# EAGLE design music_badge_v1.2_2017-09-16 (EAGLE 6.4)
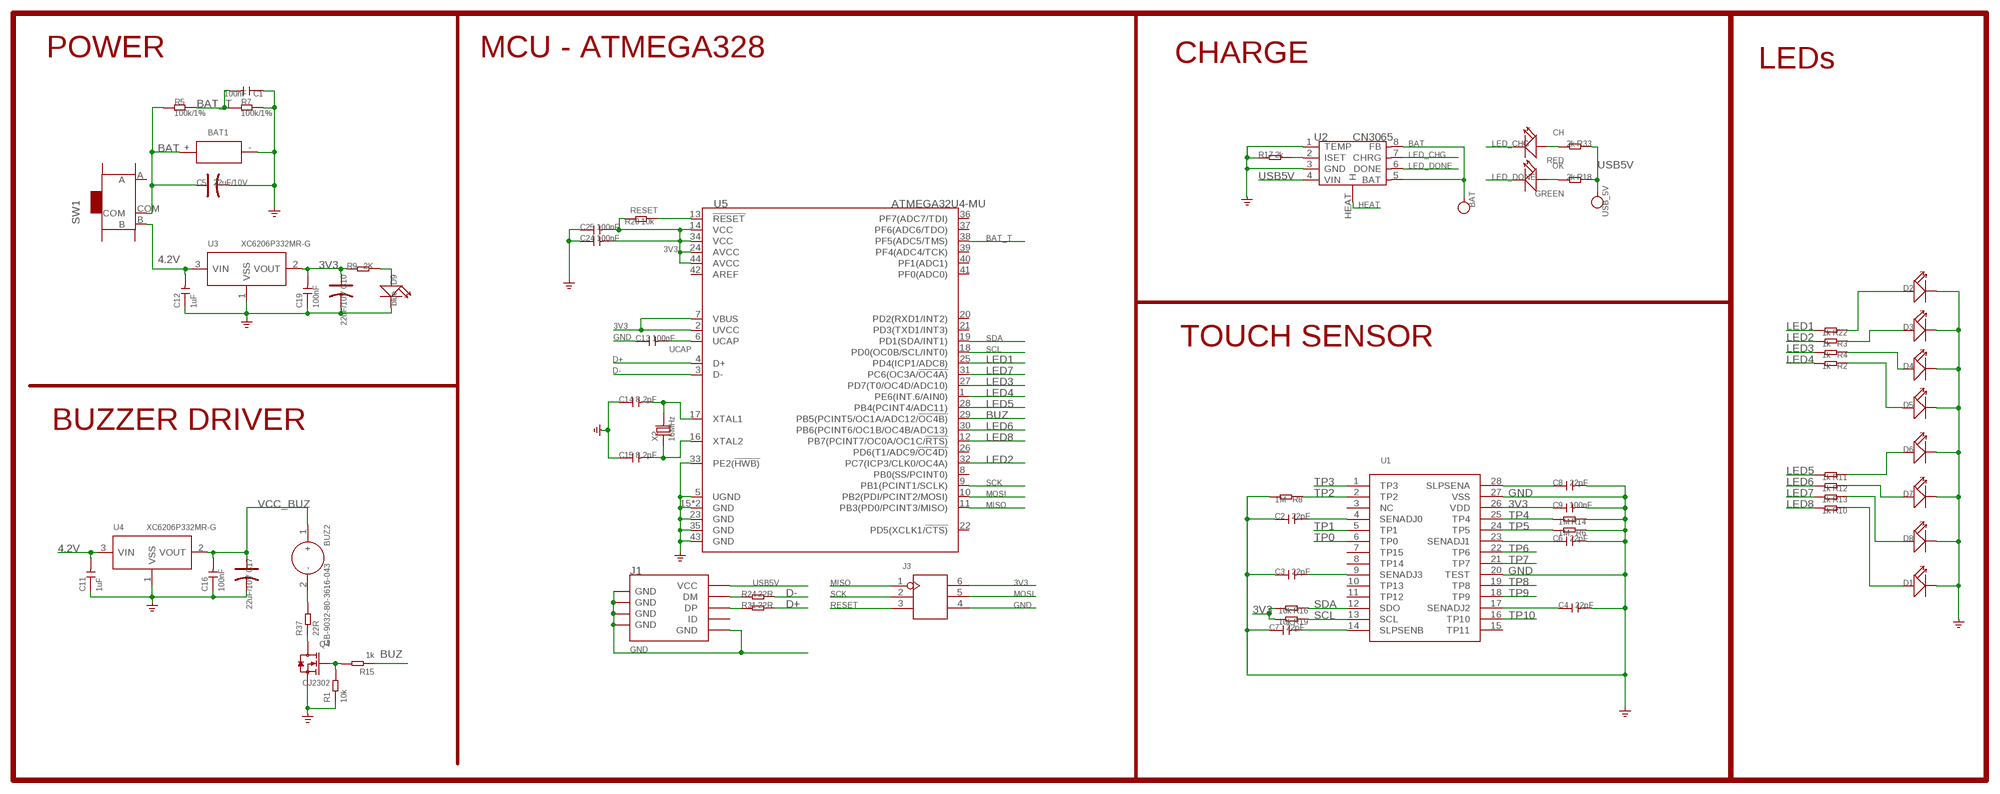
[diagram p0: schematic, sheet 1]

## Parts
BAT  TEST-POINT-35  [TP_3535]
BAT1  HOLDER-BATTERY  [2P-SMD-L28.5*W16*H5.5]
BUZ2  GB-9032-80-3616-043  BUZZER-9X3.2MM  [BZ2-SMD-9X10.6X3.2MM]
C1  100nF  C-0603  [C0603]
C2  22pF  C-0603  [C0603]
C3  22pF  C-0603  [C0603]
C4  22pF  C-0603  [C0603]
C5  22uF/10V  CAP-AVX-B  [AVX-B]
C6  22pF  C-0603  [C0603]
C7  22pF  C-0603  [C0603]
C8  22pF  C-0603  [C0603]
C9  100nF  C-0603  [C0603]
C10  22uF/10V  CAP-AVX-B  [AVX-B]
C11  1uF  CAP-0603  [C0603]
C12  1uF  CAP-0603  [C0603]
C13  100nF  C-0603  [C0603]
C14  8.2pF  C-0603  [C0603]
C15  8.2pF  C-0603  [C0603]
C16  100nF  CAP-0603  [C0603]
C17  22uF/10V  CAP-AVX-B  [AVX-B]
C19  100nF  CAP-0603  [C0603]
C24  100nF  C-0603  [C0603]
C25  100nF  C-0603  [C0603]
CH  RED  LED'0603'  [LED-0603]
D1  LED-3MM  [LED-2P-2.54-3MM]
D2  LED-3MM  [LED-2P-2.54-3MM]
D3  LED-3MM  [LED-2P-2.54-3MM]
D4  LED-3MM  [LED-2P-2.54-3MM]
D5  LED-3MM  [LED-2P-2.54-3MM]
D6  LED-3MM  [LED-2P-2.54-3MM]
D7  LED-3MM  [LED-2P-2.54-3MM]
D8  LED-3MM  [LED-2P-2.54-3MM]
D9  blue  LED'0603'  [LED-0603@1]
J1  USB-MINIUSB-5P-MICRO  [MICRO-USB]
J3  HEADER-2X3P-2.0-1.143  [H2X3-SMD-2.0(1.143)]
OK  GREEN  LED'0603'  [LED-0603]
Q4  CJ2302  MOSFET-N'SOT23'  [SOT-23]
R1  10k  RES-0603  [R0603]
R2  1k  R-0603  [R0603]
R3  1k  R-0603  [R0603]
R4  1k  R-0603  [R0603]
R5  100k/1%  R-0603  [R0603]
R6  1M  R-0603  [R0603]
R7  100k/1%  R-0603  [R0603]
R8  1M  R-0603  [R0603]
R9  2K  R-0603  [R0603]
R10  1k  R-0603  [R0603]
R11  1k  R-0603  [R0603]
R12  1k  R-0603  [R0603]
R13  1k  R-0603  [R0603]
R14  1M  R-0603  [R0603]
R15  1k  RES-0603  [R0603]
R16  10k  R-0603  [R0603]
R17  2k  R-0603  [R0603]
R18  2k  R-0603  [R0603]
R19  10k  R-0603  [R0603]
R20  10k  R-0603  [R0603]
R22  1k  R-0603  [R0603]
R24  22R  R-0603  [R0603]
R31  22R  R-0603  [R0603]
R33  2k  R-0603  [R0603]
R37  22R  RES-0603  [R0603]
SW1  SWITCH-3P-SMD-6.6X2.8  [3P-SMD-2CH-6.6X2.8-REINFORCE]
U1  TTP229-BSF  [SSOP28-0.635-10X4MM]
U2  CN3065  CN3065-DFN8  [DFN8]
U3  XC6206P332MR-G  PMIC-XC6206PMR  [SOT-23]
U4  XC6206P332MR-G  PMIC-XC6206PMR  [SOT-23]
U5  ATMEGA32U4-MU  [QFN44]
USB_5V  TEST-POINT-35  [TP_3535]
X2  16MHz  CRYSTAL'5032'  [2P-SMD-5X3.2]

## Nets
3V3: C9.1 C10.+ C19.2 C24.2 C25.2 J3.6 R9.1 R16.2 R19.2 R20.1 U1.26(VDD) U3.2(VOUT) U5.2(UVCC) U5.7(VBUS) U5.14(VCC) U5.24(AVCC) U5.34(VCC) U5.44(AVCC)
4.2V: C11.2 C12.2 SW1.B U3.3(VIN) U4.3(VIN)
BAT: BAT1.+ BAT.T C5.+ R5.1 SW1.COM U2.5(BAT) U2.8(FB)
BAT_T: C1.2 R5.2 R7.1 U5.38(PF5(ADC5/TMS))
BUZ: R15.1 U5.29(PB5(PCINT5/OC1A/ADC12/!OC4B))
D+: R31.2 U5.4(D+)
D-: R24.2 U5.3(D-)
GND [none1]: BAT1.- C1.1 C2.1 C3.1 C4.2 C5.- C6.2 C7.1 C8.2 C9.2 C10.- C11.1 C12.1 C13.1 C14.1 C15.1 C16.1 C17.- C19.1 C24.1 C25.1 D1.K(-) D2.K(-) D3.K(-) D4.K(-) D5.K(-) D6.K(-) D7.K(-) D8.K(-) D9.- J1.5(GND) J1.S1(GND) J1.S2(GND) J1.S3(GND) J1.S4(GND) J1.S5(GND) J1.S6(GND) J3.4 Q4.2(S) R1.1 R6.1 R7.2 R8.2 R14.1 R17.1 U1.20(TEST) U1.27(VSS) U2.1(TEMP) U2.3(GND) U3.1(VSS) U4.1(VSS) U5.5(UGND) U5.15(GND) U5.23(GND) U5.33(PE2(!HWB)) U5.35(GND) U5.43(GND) U5.TAB(GND) ; supply symbol labelled GND_POWER
HEAT: U2.HEAT(H)
LED1: R22.2 U5.25(PD4(ICP1/ADC8))
LED2: R3.2 U5.32(PC7(ICP3/CLK0/OC4A))
LED3: R4.2 U5.27(PD7(T0/OC4D/ADC10))
LED4: R2.2 U5.1(PE6(INT.6/AIN0))
LED5: R11.2 U5.28(PB4(PCINT4/ADC11))
LED6: R12.2 U5.30(PB6(PCINT6/OC1B/OC4B/ADC13))
LED7: R13.2 U5.31(PC6(OC3A/!OC4A))
LED8: R10.2 U5.12(PB7(PCINT7/OC0A/OC1C/!RTS))
LED_CHG: CH.- U2.7(CHRG)
LED_DONE: OK.- U2.6(DONE)
MISO: J3.1 U5.11(PB3(PD0/PCINT3/MISO))
MOSI: J3.5 U5.10(PB2(PDI/PCINT2/MOSI))
N$1: C2.2 U1.4(SENADJ0)
N$2: C3.2 U1.9(SENADJ3)
N$3: D9.+ R9.2
N$4: C7.2 U1.14(SLPSENB)
N$5: C6.1 U1.23(SENADJ1)
N$6: C14.2 U5.17(XTAL1) X2.2
N$7: R17.2 U2.2(ISET)
N$8: C4.1 U1.17(SENADJ2)
N$9: C8.1 U1.28(SLPSENA)
N$10: OK.+ R18.2
N$11: BUZ2.2(-) R37.2
N$12: C15.2 U5.16(XTAL2) X2.1
N$13: CH.+ R33.2
N$14: D6.A(+) R11.1
N$15: D2.A(+) R22.1
N$16: D7.A(+) R12.1
N$17: D1.A(+) R10.1
N$18: J1.2(DM) R24.1
N$19: Q4.1(G) R1.2 R15.2
N$20: D4.A(+) R4.1
N$21: D3.A(+) R3.1
N$22: D5.A(+) R2.1
N$24: D8.A(+) R13.1
N$27: J1.3(DP) R31.1
N$43: Q4.3(D) R37.1
RESET: J3.3 R20.2 U5.13(!RESET)
SCK: J3.2 U5.9(PB1(PCINT1/SCLK))
SCL: R19.1 U1.13(SCL) U5.18(PD0(OC0B/SCL/INT0))
SDA: R16.1 U1.12(SDO) U5.19(PD1(SDA/INT1))
TP0: U1.6(TP0)
TP1: U1.5(TP1)
TP2: R8.1 U1.2(TP2)
TP3: U1.1(TP3)
TP4: R14.2 U1.25(TP4)
TP5: R6.2 U1.24(TP5)
TP6: U1.22(TP6)
TP7: U1.21(TP7)
TP8: U1.19(TP8)
TP9: U1.18(TP9)
TP10: U1.16(TP10)
UCAP: C13.2 U5.6(UCAP)
USB5V: J1.1(VCC) R18.1 R33.1 U2.4(VIN) USB_5V.T
VCC_BUZ: BUZ2.1(+) C16.2 C17.+ U4.2(VOUT)
Unconnected: J1.4(ID) SW1.A SW1.SS1 SW1.SS2 SW1.SS3 SW1.SS4 U1.3(NC) U1.7(TP15) U1.8(TP14) U1.10(TP13) U1.11(TP12) U1.15(TP11) U5.8(PB0(SS/PCINT0)) U5.20(PD2(RXD1/INT2)) U5.21(PD3(TXD1/INT3)) U5.22(PD5(XCLK1/!CTS)) U5.26(PD6(T1/ADC9/!OC4D)) U5.36(PF7(ADC7/TDI)) U5.37(PF6(ADC6/TDO)) U5.39(PF4(ADC4/TCK)) U5.40(PF1(ADC1)) U5.41(PF0(ADC0)) U5.42(AREF)

## Notes on the sheet
- POWER | MCU - ATMEGA328 | CHARGE
- LEDs
- TOUCH SENSOR
- BUZZER DRIVER

## Library data of the parts
BAT USB_5V = Discrete-new:TEST-POINT
BAT1 = goodman:HOLDER-BATTERY
BUZ2 = Discrete-new:BUZZER: BZ2-5.0-D9.0XH5.5MM: 312020001;BZ2-7.6-D12.0XH6.5MM: 312020006; BZ3-SMD-5.0X5.0X2.5MM:312020004
C1-C4 C6-C9 C13-C15 C24 C25 = Discrete:C*: Ceramic Capacitors
C5 C10 C17 = Discrete:CAP*: Electrolytic Capacitors,Tantalum Capacitors and Super Capacitors
C11 C12 C16 C19 = Discrete-new:CAP: Ceramic Capacitors
CH OK = Discrete-new:LED
D1-D9 = Discrete:LED*
J1 = Connector :USB-MINIUSB-5P
J3 = Connector-new:HEADER-2X3P
Q4 = Discrete-new:MOSFET-N
R1 R15 R37 = Discrete-new:RES
R2-R14 R16-R20 R22 R24 R31 R33 = Discrete:R*
SW1 = Discrete:SWITCH-3P-SMD
U1 = IC-new:TTP229-BSF
U2 = IC:CN3065: USB-Compatible Lithiumt-Ion Battery Charger with Thermal Regulation http://www.consonance-elec.com/pdf/%E6%8A%80%E6%9C%AF%E8%AF%B4%E6%98%8E%E4%B9%A6/DSC-CN3065.pdf
U3 U4 = IC-new:PMIC-XC6206P: LOW ESR Cap.Compatible Positive Voltage Regulators
U5 = IC:ATMEGA32U4: 8-bit Microcontroller With 16/32K Bytes of ISP Flash and USB controller
X2 = Discrete:CRYSTAL*: CRYSTAL

## Net classes
0 default: width 0.203 mm, drill 0.254 mm, clearance 0.152 mm

## Board
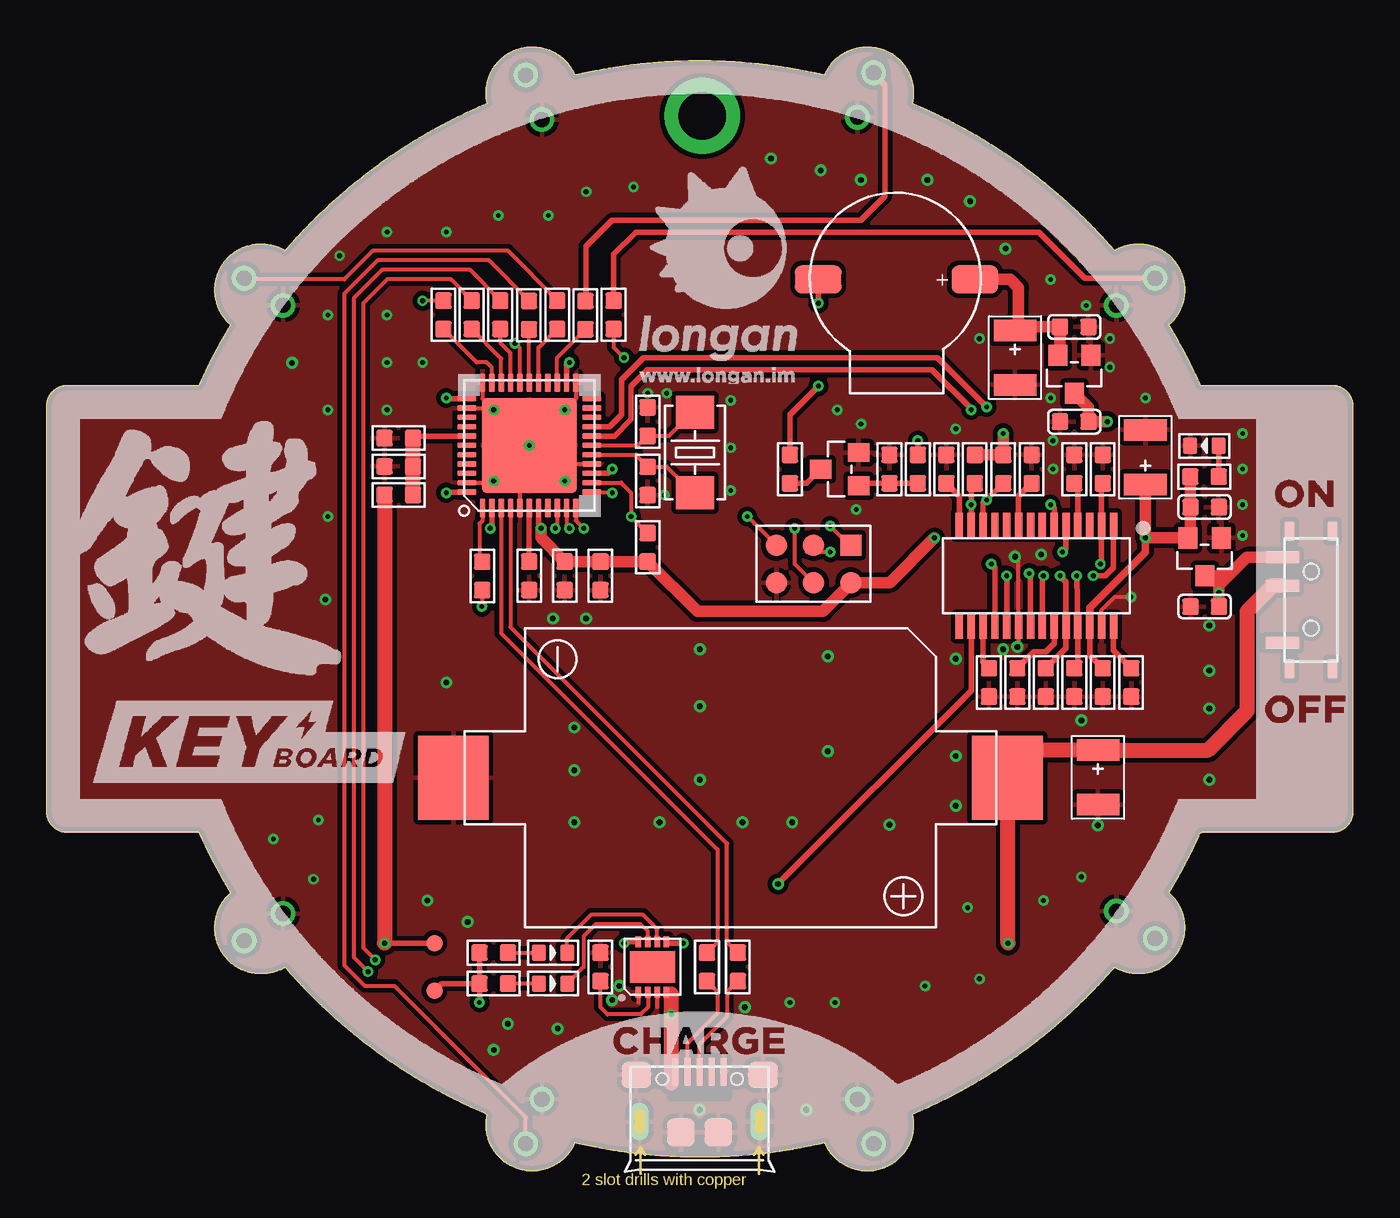
[diagram p1: board, top side]
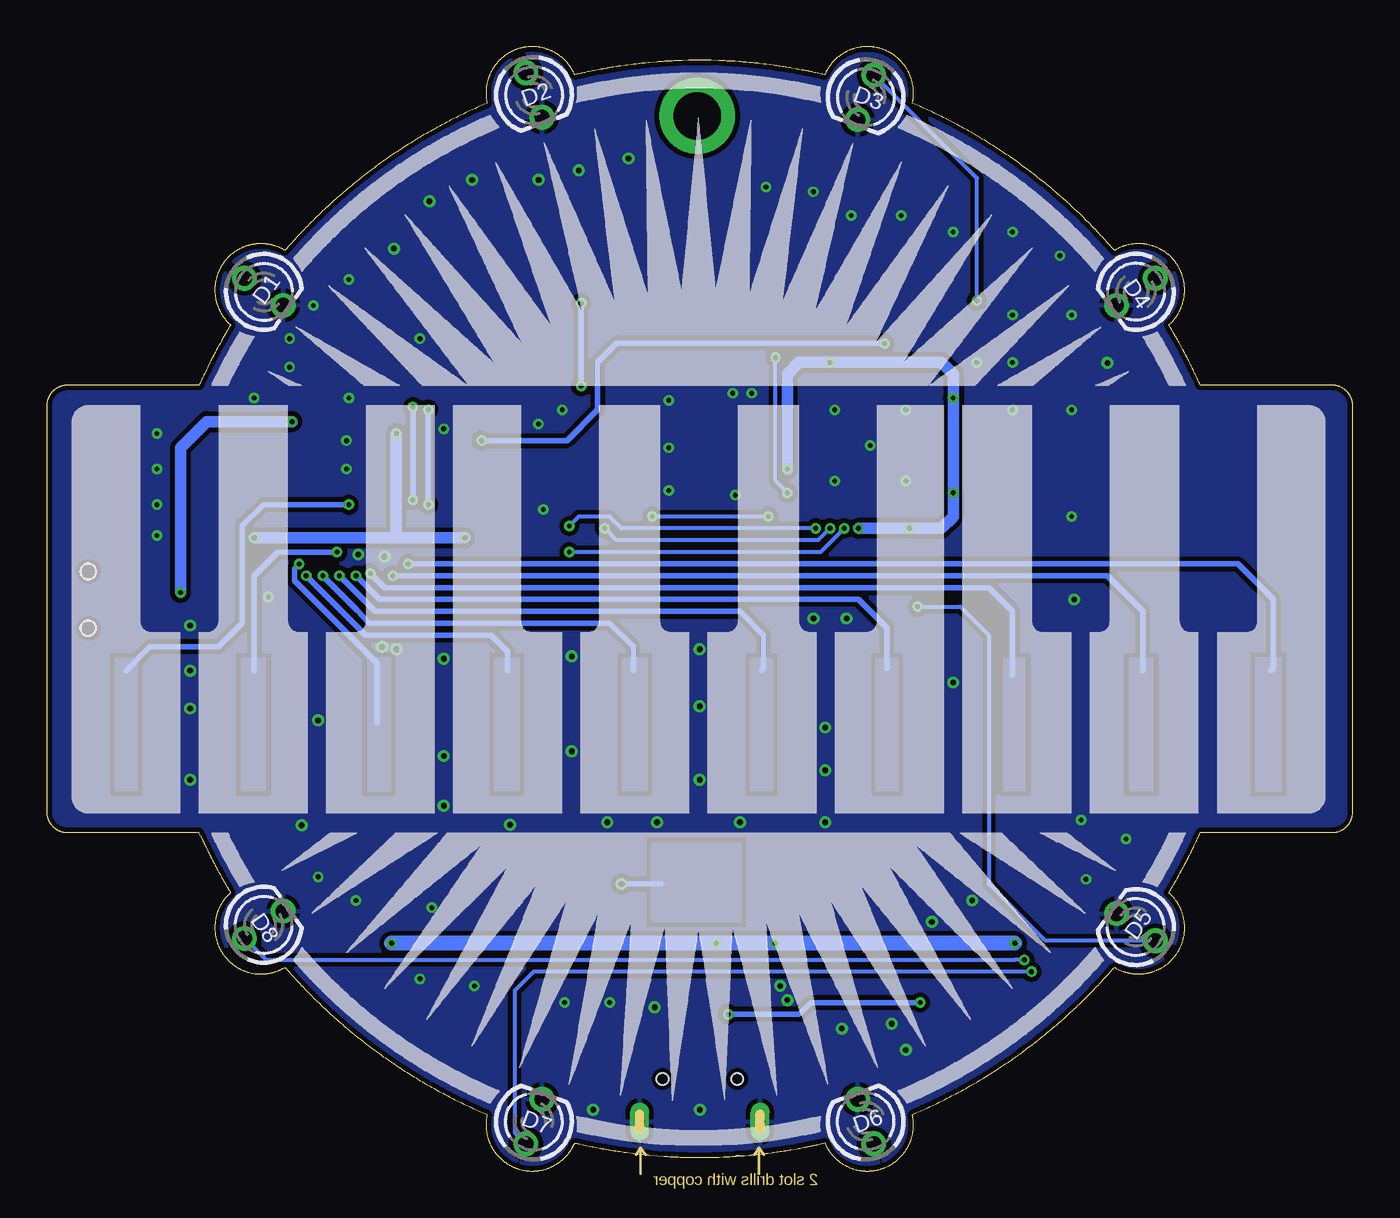
[diagram p2: board, bottom side, seen from below]

Size 70 x 60.23 mm. Coordinates in mm from the lower left corner, seen from the top.
Outline: 2617 segments
Copper layers (1*16): Top 0.035mm / dielectric 1.5mm / Bottom 0.035mm
Design rules "SeeedStudio_2layer_DRU_no_angle_20140221 *": minimum track width 6mil, minimum drill 10mil, track to track 6mil, track to pad 6mil, pad to pad 6mil, via to via 6mil, smd to smd 0mil, copper to edge 10mil, drill to drill 10mil, minimum pad ring 10mil, minimum via ring 6mil, stop-mask expansion 2mil, vias tented up to drill 25mil, thermal gap 10mil

### Footprints (pad centres in the part's own frame; a part is rotated, then mirrored left to right if it is on the bottom)
TP_3535 = smd 0.889 x 0.889: T 0,0
2P-SMD-L28.5*W16*H5.5 = smd 3.8 x 4.5: + 14.85,0; - -14.85,0
BZ2-SMD-9X10.6X3.2MM = smd 2.5 x 1.5: 1 4.2,0; 2 -4.2,0
C0603 = smd 0.889 x 0.889: 1 -0.762,0; 2 0.762,0
AVX-B = smd 1.143 x 2.286: + -1.46,0; - 1.46,0
C0603' = smd 0.889 x 0.889: 1 0,0.762; 2 0,-0.762
LED-0603 = smd 0.762 x 0.889: + 0.762,0; - -0.762,0
LED-2P-2.54-3MM = drill 0.813: A -1.27,0; K 1.27,0
LED-0603' = smd 0.762 x 0.889: + -0.762,0; - 0.762,0
MICRO-USB = smd 0.381 x 1.524: 1 -1.3,-0.25; 2 -0.65,-0.25; 3 0,-0.25; 4 0.65,-0.25; 5 1.3,-0.25 | smd 1.6 x 1.397: S1 -3.4,-0.427; S6 3.4,-0.427 | drill 0.508 pad 1.016 long: S2 -3.226,-2.921; S5 3.226,-2.921 | smd 1.5 x 1.5: S3 -1,-3.5; S4 1,-3.5 | hole 0.635: -2,-0.65; 2,-0.65
H2X3-SMD-2.0(1.143) = smd 1.143 x 1.143: 1 -1,2; 2 -1,0; 3 -1,-2; 4 1,-2; 5 1,0; 6 1,2
SOT-23 = smd 1.143 x 1.016: 1 1.016,-0.889; 2 1.016,0.889; 3 -1.016,0
R0603 = smd 0.889 x 0.889: 1 0,0.762; 2 0,-0.762
R0603' = smd 0.889 x 0.889: 1 -0.762,0; 2 0.762,0
3P-SMD-2CH-6.6X2.8-REINFORCE = smd 1.778 x 0.635: A 1.524,2.286; B 1.524,-2.286; COM 1.524,-0.762 | smd 0.508 x 1.016: SS1 -1.143,-3.683; SS2 1.143,-3.683; SS3 1.143,3.683; SS4 -1.143,3.683 | hole 0.813: 0,-1.524; 0,1.524
SSOP28-0.635-10X4MM = smd 0.4 x 1.3: 1 -4.128,-2.723; 2 -3.493,-2.723; 3 -2.857,-2.723; 4 -2.223,-2.723; 5 -1.587,-2.723; 6 -0.953,-2.723; 7 -0.318,-2.723; 8 0.318,-2.723; 9 0.953,-2.723; 10 1.587,-2.723; 11 2.223,-2.723; 12 2.857,-2.723; 13 3.493,-2.723; 14 4.128,-2.723; 15 4.128,2.723; 16 3.493,2.723; 17 2.857,2.723; 18 2.223,2.723; 19 1.587,2.723; 20 0.953,2.723; 21 0.318,2.723; 22 -0.318,2.723; 23 -0.953,2.723; 24 -1.587,2.723; 25 -2.223,2.723; 26 -2.857,2.723; 27 -3.493,2.723; 28 -4.128,2.723
DFN8 = smd 0.3 x 0.6: 1 -0.75,-1.35; 2 -0.25,-1.35; 3 0.25,-1.35; 4 0.75,-1.35; 5 0.75,1.35; 6 0.25,1.35; 7 -0.25,1.35; 8 -0.75,1.35 | smd 2.4 x 1.7: HEAT 0,0
SOT-23' = smd 1.016 x 1.143: 1 -0.889,-1.016; 2 0.889,-1.016; 3 0,1.016
QFN44 = smd 1 x 0.3: 1 -3.35,2.5; 2 -3.35,2; 3 -3.35,1.5; 4 -3.35,1; 5 -3.35,0.5; 6 -3.35,0; 7 -3.35,-0.5; 8 -3.35,-1; 9 -3.35,-1.5; 10 -3.35,-2; 11 -3.35,-2.5; 23 3.35,-2.5; 24 3.35,-2; 25 3.35,-1.5; 26 3.35,-1; 27 3.35,-0.5; 28 3.35,0; 29 3.35,0.5; 30 3.35,1; 31 3.35,1.5; 32 3.35,2; 33 3.35,2.5 | smd 0.3 x 1: 12 -2.5,-3.35; 13 -2,-3.35; 14 -1.5,-3.35; 15 -1,-3.35; 16 -0.5,-3.35; 17 0,-3.35; 18 0.5,-3.35; 19 1,-3.35; 20 1.5,-3.35; 21 2,-3.35; 22 2.5,-3.35; 34 2.5,3.35; 35 2,3.35; 36 1.5,3.35; 37 1,3.35; 38 0.5,3.35; 39 0,3.35; 40 -0.5,3.35; 41 -1,3.35; 42 -1.5,3.35; 43 -2,3.35; 44 -2.5,3.35 | smd 5.08 x 5.08: TAB 0,0
2P-SMD-5X3.2 = smd 1.778 x 2.032: 1 -2.159,0; 2 2.159,0

### Placement (x,y rotation side)
BAT  20.78,12.2 0 top
BAT1  36.65,21.07 0 top
BUZ2  45.55,47.76 0 top
C1  18.87,39.27 0 top
C2  55.07,37.6 270 top
C3  52.79,37.6 270 top
C4  50.5,26.17 270 top
C5  56.34,21.09 270 top
C6  52.02,26.17 270 top
C7  48.21,37.6 270 top
C8  58.12,26.17 270 top
C9  56.6,26.17 270 top
C10  58.88,38.24 90 top
C11  1uF  [C0603']  55.07,40.14 90 top
C12  1uF  [C0603']  62.06,30.24 90 top
C13  25.86,31.89 90 top
C14  32.21,40.14 270 top
C15  32.21,36.97 90 top
C16  100nF  [C0603']  55.07,45.22 270 top
C17  51.9,43.57 270 top
C19  100nF  [C0603']  62.06,35.57 270 top
C24  27.77,31.89 90 top
C25  29.67,31.89 90 top
CH  27.13,10.05 180 top
D1  58.36,47.1 325 bottom
D2  43.88,57.65 290 bottom
D3  26.1,57.52 250 bottom
D4  11.63,47.1 215 bottom
D5  11.63,13.07 145 bottom
D6  26.1,2.65 110 bottom
D7  43.88,2.65 70 bottom
D8  58.36,13.2 35 bottom
D9  blue  [LED-0603']  62.05,38.85 180 top
J1  34.99,5.58 0 top
J3  41.1,32.52 270 top
OK  27.13,11.7 180 top
Q4  42.5,37.6 0 top
R1  45.17,37.6 0 top
R2  1k  [R0603']  23.35,31.88 90 top
R3  1k  [R0603']  21.26,45.87 270 top
R4  1k  [R0603']  27.36,45.87 270 top
R5  100k/1%  [R0603']  18.87,36.22 0 top
R6  1M  [R0603']  53.55,26.17 90 top
R7  100k/1%  [R0603']  18.87,37.74 180 top
R8  1M  [R0603']  56.6,37.6 90 top
R9  2K  [R0603']  62.05,37.2 0 top
R10  1k  [R0603']  30.38,45.87 270 top
R11  1k  [R0603']  25.85,45.85 270 top
R12  1k  [R0603']  24.3,45.87 270 top
R13  1k  [R0603']  22.78,45.87 270 top
R14  1M  [R0603']  55.07,26.17 90 top
R15  46.69,37.6 0 top
R16  10k  [R0603']  51.26,37.6 90 top
R17  2k  [R0603']  29.67,10.93 270 top
R18  2k  [R0603']  23.96,11.7 0 top
R19  10k  [R0603']  49.74,37.6 90 top
R20  10k  [R0603']  32.21,33.41 90 top
R22  1k  [R0603']  28.87,45.85 270 top
R24  22R  [R0603']  35.39,10.93 90 top
R31  22R  [R0603']  37.04,10.93 90 top
R33  2k  [R0603']  23.96,10.05 0 top
R37  39.83,37.6 180 top
SW1  67.76,30.59 180 top
U1  53.04,31.89 180 top
U2  32.47,10.93 0 top
U3  XC6206P332MR-G  [SOT-23']  62.06,32.91 180 top
U4  XC6206P332MR-G  [SOT-23']  55.07,42.68 180 top
U5  25.86,38.87 90 top
USB_5V  20.78,9.66 0 top
X2  34.75,38.49 90 top

### Tracks (layer width: path | path; a pad name or v marks a point on that pad's centre or on a via)
3V3  (via drill 0.25 pad 0.51)
  Top 0.305: U5.24 27.86,43.16 v28.02,43.32 | U5.14 30.08,37.37 v30.31,37.6 | U5.34 21.46,41.37 v21.42,41.41 | U5.44 21.46,36.37 v21.42,36.33 | U5.2 23.86,34.53 v23.77,34.43 | U5.7 26.36,34.56 v26.5,34.43 | U1.26 55.9,27.64 C9.1
  Top 0.406: v58.88,33.92 58.88,33.16 55.9,30.18 U1.26
  Top 0.61: R9.1 C19.2 61.29,34.05 U3.2 v58.88,33.92 C10.+ | v47.58,33.92 45.18,31.52 J3.6 43.1,31.48 41.61,29.98 34.88,29.98 R20.1 C25.2 C24.2 26.5,33.92 v26.5,34.43 | R19.2 R16.2 v51.26,39.51
  Bottom 0.305: v26.5,34.43 25.73,34.43
  Bottom 0.61: v30.31,37.6 30.31,42.68 29.67,43.32 v28.02,43.32 22.05,43.32 21.42,42.68 v21.42,41.41 v21.42,36.33 21.42,35.06 22.05,34.43 v23.77,34.43 v26.5,34.43 | v58.88,33.92 51.26,33.92 | 51.26,33.92 v47.58,33.92 | v51.26,39.51 51.26,33.92
4.2V  (via drill 0.25 pad 0.51)
  Top 0.61: U3.3 62.69,31.89 | 62.69,31.89 63.33,31.89 | 63.33,31.89 64.32,32.88 SW1.B | 62.69,31.89 62.82,31.76 v62.82,31 C12.2 | 63.33,31.89 62.95,31.51 | U4.3 55.83,40.91 C11.2 v56.85,40.14
  Bottom 0.61: v62.82,31 62.82,38.75 61.42,40.14 v56.85,40.14
BAT  (via drill 0.25 pad 0.51)
  Top 0.305: U2.8 31.02,12.28 v30.94,12.2 | v34.12,12.2 33.3,12.2 U2.5 | 18.1,12.21 20.77,12.21 BAT.T
  Top 0.813: 55.66,22.63 C5.+ | C5.+ 51.58,22.55 51.52,22.62 51.52,21.09 BAT1.+ 51.52,21.05 v51.52,12.2 | C5.+ 62.25,22.55 64.34,24.65 64.34,29.98 65.71,31.36 SW1.COM | R5.1 18.1,12.21 v18.11,12.2
  Bottom 0.813: v51.52,12.2 v34.12,12.2 v30.94,12.2 v18.11,12.2
BAT_T
  Top 0.305: U5.38 19.73,39.37 C1.2
  Top 0.813: R5.2 R7.1 C1.2
BUZ  (via drill 0.25, 0.25 pad 0.51)
  Top 0.203: U5.29 25.36,44.07 v25.1,44.34
  Top 0.305: v46.69,39.13 R15.1
  Bottom 0.305: v25.1,44.34 39.45,44.34 40.47,43.32 40.47,40.78 42.12,39.13 v46.69,39.13
D+
  Top 0.203: U5.4 24.86,29.14 36.47,17.54 36.47,12.27 R31.2
D-
  Top 0.203: U5.3 24.36,28.82 35.96,17.22 35.96,12.27 R24.2
GND  (via drill 0.25 pad 0.51, 0.3 pad 0.64)
  Top 0.203: U5.35 23.86,40.87 v23.96,40.78 23.36,41.37 U5.33 | U5.15 26.89,37.87 26.88,37.86 | v27.77,36.97 26.88,37.86 | U5.5 25.36,36.98 26.24,37.86 26.88,37.86 | U5.43 23.86,36.87 v23.96,36.97 | U2.3 32.72,8.78 | U2.1 31.72,9.04 31.7,9.03 | U5.23 28.36,41.37 v27.77,40.78 | 52.02,27.95 52.09,28.02 U1.20 52.09,32.97 51.9,33.16 | U1.27 56.53,30.05 57.23,30.75 v58.12,30.75
  other vias: 34.99,3.29 40.71,3.29 13.15,43.29 37.42,8.78 25.86,38.87 18.24,40.78 18.24,43.32 18.24,45.86 20.15,43.32 30.69,9.92 24.72,7.89 27.39,7.63 14.94,30.62 20.4,14.49 23.96,6.49 22.56,13.35 21.42,26.17 56.33,18.53 39.83,9.03 42.24,9.03 47.07,9.92 49.99,10.3 49.36,14.11 53.42,14.49 14.3,15.63 14.56,18.81 12.15,17.79 28.91,52.46 15.07,35.06 15.07,40.78 15.07,45.86 15.7,49.03 18.24,50.3 21.42,50.3 24.21,51.19 33.1,36.21 32.21,41.67 33.23,41.67 58.88,41.41 55.45,15.76 56.98,44.59 64.09,35.7 64.09,37.6 64.09,39.51 27.13,29.6 28.91,29.6 52.02,28.08 26.88,51.19 31.45,52.72 53.8,47.76 55.71,46.37 42.37,40.78 43.39,35.45 53.8,41.41 49.99,44.59 64.09,34.05 51.26,27.95 51.9,32.91 53.29,33.03 56.98,43.07 43.64,40.02 48.72,39.76 53.93,37.6 53.93,39.13 36.66,38.75 36.66,36.46 36.66,41.29 30.31,9.16 55.45,24.14 62.31,29.22 62.31,26.81 62.31,24.78 62.31,20.97 48.72,27.44 48.72,22.24 41.86,22.49 41.86,27.57 35.01,27.95 35.01,24.9 35.01,20.97 37.29,18.68 39.96,18.68 45.17,18.55 48.72,19.57 32.85,18.68 28.27,18.68 28.27,21.48 28.27,23.76 38.82,54.24 41.48,53.61 43.64,53.1 47.2,53.1 49.48,51.96 51.39,49.42
  pour Top (isolate 0.254, rank 6): 72.84,-1.79 -1.45,-1.79 -1.45,62.6 72.84,62.6
  pour Bottom (isolate 0.254, rank 6): -1.57,-2.02 71.58,-2.02 71.58,63.64 -1.57,63.64
LED1
  Top 0.203: U5.25 27.36,43.58 R22.2
LED2
  Top 0.203: U5.32 23.86,43.03 23.58,43.32 23.05,43.32 R3.2
LED3
  Top 0.203: U5.27 26.36,44.11 R4.2
LED4
  Top 0.203: U5.1 23.36,34.85 23.19,34.68 23.19,32.79 R2.2
  Top 0.305: 23.36,32.66 R2.2
LED5
  Top 0.203: U5.28 25.86,45.07 R11.2
LED6
  Top 0.203: U5.30 24.86,43.81 24.34,44.34 24.34,45.07 R12.2
LED7
  Top 0.203: U5.31 24.36,43.53 R13.2
LED8  (via drill 0.25 pad 0.51)
  Top 0.203: 30.31,45.03 R10.2 30.38,44.13 v30.94,43.57 | U5.12 30.27,36.37 v30.31,36.33
  Bottom 0.203: v30.31,36.33 30.94,36.97 v30.94,43.57
LED_CHG
  Top 0.203: U2.7 32.22,12.84 31.83,13.22 29.42,13.22 28.78,12.59 28.78,11.06 28.78,10.93 CH.-
LED_DONE
  Top 0.203: U2.6 32.72,12.97 31.96,13.73 29.16,13.73 27.89,12.46 OK.-
MISO  (via drill 0.25 pad 0.51)
  Top 0.203: U5.11 28.36,34.85 v28.78,34.43 | J3.1 43.01,33.62 42.93,33.62 v41.99,34.56
  Bottom 0.203: v28.78,34.43 39.2,34.43 39.83,35.06 41.48,35.06 v41.99,34.56
MOSI  (via drill 0.25 pad 0.51)
  Top 0.203: U5.10 27.86,34.59 v28.02,34.43 | v40.09,34.43 40.09,32.54 J3.5
  Bottom 0.203: v28.02,34.43 28.66,33.79 39.45,33.79 v40.09,34.43
N$1
  Top 0.305: U1.4 55.26,36.65 C2.2
N$2
  Top 0.305: U1.9 52.09,36.14 C3.2
N$3
  Top 0.305: R9.2 D9.+
N$4
  Top 0.305: U1.14 48.91,36.14 C7.2
N$5
  Top 0.305: U1.23 53.99,28.27 53.55,27.83 52.91,27.83 C6.1
N$6
  Top 0.203: U5.17 31.7,38.87 C14.2 33.35,39.38 34.24,40.27 34.37,40.27 X2.2
N$7
  Top 0.203: U2.2 32.22,8.78 31.83,8.39 30.05,8.39 29.67,8.78 R17.2
N$8
  Top 0.305: U1.17 50.18,27.25 C4.1
N$9
  Top 0.305: U1.28 57.17,27.89 C8.1
N$10
  Top 0.203: R18.2 OK.+
N$11  (via drill 0.25 pad 0.51)
  Top 0.305: R37.2 39.83,40.53 v41.36,42.05 | v41.36,46.49 BUZ2.2
  Bottom 0.305: v41.36,42.05 v41.36,46.49
N$12
  Top 0.203: U5.16 31.57,38.37 C15.2 33.23,37.73 34.12,36.84 34.24,36.84 X2.1
N$13
  Top 0.203: CH.+ R33.2
N$14
  Top 0.203: R11.1 25.85,46.64 23.7,48.78 17.73,48.78 15.96,47 15.96,11.01 17.05,9.92 18.62,9.92 25.67,2.87 D6.A
N$15
  Top 0.203: R22.1 28.9,46.61
  Top 0.305: D2.A 44.32,58.77 44.91,58.18 44.91,52.21 43.64,50.94 30.31,50.94 28.9,49.53 28.9,46.61
N$16  (via drill 0.25 pad 0.51)
  Top 0.203: R12.1 24.3,46.66 22.69,48.27 17.99,48.27 16.46,46.75 16.46,11.44 v17.23,10.68
  Bottom 0.203: v17.23,10.68 43.9,10.68 44.91,9.66 44.91,2.05 D7.A
N$17
  Top 0.305: R10.1 30.38,49.11 31.58,50.3 53.17,50.3 55.64,47.83 D1.A
N$18
  Top 0.203: J1.2 34.34,6.85 35.96,8.46 35.96,9.6 R24.1
N$19
  Top 0.305: R15.2 R1.2 43.64,36.84 Q4.1
N$20
  Top 0.203: R4.1 27.36,46.65 24.72,49.29 17.48,49.29 15.96,47.76 10.65,47.76 D4.A
N$21  (via drill 0.25 pad 0.51)
  Top 0.203: R3.1 v20.16,46.63 v20.15,46.62
  Bottom 0.203: v20.15,46.62 20.15,53.19 D3.A
N$22  (via drill 0.25 pad 0.51)
  Top 0.203: R2.1 23.35,30.26 v23.32,30.24
  Bottom 0.203: D5.A 16.47,12.34 19.51,15.38 19.51,28.71 21.04,30.24 v23.32,30.24
N$24  (via drill 0.25 pad 0.51)
  Top 0.203: R13.1 22.78,46.66 21.67,47.76 18.24,47.76 16.97,46.49 16.97,11.95 v17.61,11.32
  Bottom 0.203: D8.A 58.25,11.32 18.11,11.32 v17.61,11.32
N$27
  Top 0.203: J1.3 34.99,6.8 36.47,8.27 36.47,9.6 R31.1
N$34  (via drill 2.54 pad 4.06)
  other vias: 35.13,56.53
N$43
  Top 0.305: R37.1 40.72,36.84 Q4.3
RESET  (via drill 0.25 pad 0.51)
  Top 0.203: U5.13 30.78,36.87 31.32,36.33 v31.32,35.06 R20.2 | v37.55,35.06 37.93,34.7 J3.3
  Bottom 0.203: v31.32,35.06 v37.55,35.06
SCK  (via drill 0.25 pad 0.51)
  Top 0.203: U5.9 27.36,34.53 v27.26,34.43 | v41.99,33.16 40.74,33.16 J3.2
  Bottom 0.203: v27.26,34.43 28.53,33.16 v41.99,33.16
SCL  (via drill 0.25 pad 0.51)
  Top 0.305: U5.18 30.43,39.37 31.32,40.27 31.32,42.05 32.21,42.94 47.45,42.94 49.55,40.84 v49.55,40.78 | U1.13 v49.55,35.7 49.55,36.65 R19.1
  Bottom 0.305: v49.55,35.7 v49.55,40.78
SDA  (via drill 0.25 pad 0.51)
  Top 0.305: U5.19 30.16,39.87 30.81,40.53 30.81,42.4 31.99,43.57 47.73,43.57 v50.37,40.93 | U1.12 50.18,35.76 v50.37,35.95 R16.1
  Bottom 0.305: v50.37,35.95 v50.37,40.93
TP0  (via drill 0.25 pad 0.51)
  Top 0.305: U1.6 53.99,35.51 v53.8,35.7
  Bottom 0.305: v53.8,35.7 58.37,35.7 59.52,34.56 59.52,29.35 60.79,28.08 64.47,28.08 65.74,26.81
  pour Bottom: 66.24,27.42 65.22,27.42 65.22,20.43 66.24,20.43
TP1  (via drill 0.25 pad 0.51)
  Top 0.305: U1.5 54.63,33.35 v54.44,33.16
  Bottom 0.305: v54.44,33.16 57.61,33.16 58.88,31.89 58.88,26.81
  pour Bottom: 59.51,20.43 59.51,27.42 58.36,27.42 58.36,20.43
TP2  (via drill 0.25 pad 0.51)
  Top 0.305: R8.1 56.53,36.78 U1.2 56.53,32.71 v56.47,32.52
  Bottom 0.305: 52.28,24.02 52.28,27.19 56.72,31.64 56.72,32.27 v56.47,32.52
  pour Bottom: 51.63,27.42 52.77,27.42 52.77,20.43 51.63,20.43
TP3  (via drill 0.25 pad 0.51)
  Top 0.305: v56.09,31.89 56.74,31.89 57.17,32.32 U1.1
  Bottom 0.305: 45.29,26.81 45.29,27.83 46.18,28.71 52.91,28.71 v56.09,31.89
  pour Bottom: 45.92,20.43 45.92,27.42 44.77,27.42 44.77,20.43
TP4  (via drill 0.25 pad 0.51)
  Top 0.305: R14.2 55.26,27.13 U1.25 v55.2,31.89
  Bottom 0.305: 38.56,26.81 38.56,28.08 39.83,29.35 52.72,29.35 53.36,30.05 v55.2,31.89
  pour Bottom: 39.06,27.42 37.92,27.42 37.92,20.43 39.06,20.43
TP5  (via drill 0.25 pad 0.51)
  Top 0.305: R6.2 54.63,28.02 U1.24 54.63,31.57 v54.31,31.89
  Bottom 0.305: 31.7,26.81 31.58,26.94 31.58,28.71 32.85,29.98 52.4,29.98 v54.31,31.89
  pour Bottom: 32.2,27.42 31.18,27.42 31.18,20.43 32.2,20.43
TP6  (via drill 0.25 pad 0.51)
  Top 0.305: U1.22 53.36,31.83 v53.42,31.89
  Bottom 0.305: 24.97,26.94 24.97,29.1 26.5,30.62 52.15,30.62 v53.42,31.89
  pour Bottom: 25.47,27.42 24.45,27.42 24.45,20.43 25.47,20.43
TP7  (via drill 0.25 pad 0.51)
  Top 0.305: U1.21 52.72,31.42 52.72,31.7 52.72,31.95 v52.66,32.02
  Bottom 0.305: 18.24,26.56 18.24,29.98 19.51,31.25 51.9,31.25 v52.66,32.02
  pour Bottom: 18.61,27.42 17.6,27.42 17.6,20.43 18.61,20.43
TP8  (via drill 0.25 pad 0.51)
  Top 0.305: U1.19 v51.45,31.89
  Bottom 0.305: 11.26,26.81 11.26,29.98 13.16,31.89 v51.45,31.89
  pour Bottom: 11.88,27.42 10.74,27.42 10.74,20.43 11.88,20.43
TP9  (via drill 0.25 pad 0.51)
  Top 0.305: U1.18 50.82,32.33 v50.63,32.52
  Bottom 0.305: v50.63,32.52 6.18,32.52 4.27,30.62 4.27,26.94 4.4,26.81
  pour Bottom: 5.15,20.43 3.88,20.43 3.88,27.42 5.15,27.42
TP10  (via drill 0.3)
  Top 0.305: U1.16 49.55,25.73 v39.2,15.38
  Bottom 0.305: v39.2,15.38 37.04,15.38
  pour Bottom: 37.53,13.45 32.84,13.45 32.84,17.51 37.53,17.51
UCAP
  Top 0.305: U5.6 C13.2
USB5V  (via drill 0.25 pad 0.51)
  Top 0.203: 33.48,5.85 33.57,5.85 | 33.57,5.85 33.7,5.98 | U2.4 33.31,9.58 33.48,9.47 | 33.48,4.71 33.48,5.77 33.57,5.85
  Top 0.305: J1.1 33.7,5.98 33.7,6.28 | R33.1 R18.1 | R33.1 v23.19,9.03 | R33.1 21.16,10.05 USB_5V.T
  Top 0.813: 33.48,4.71 v33.48,8.39 33.48,9.47
  Bottom 0.305: v23.19,9.03 29.04,9.03 29.67,8.39 v33.48,8.39
VCC_BUZ
  Top 0.61: 52.09,45.22 C16.2 54.31,43.83 U4.2 | 52.09,45.22 C17.+ | 52.09,45.22 52.09,47.32 51.64,47.76 BUZ2.1